# EAGLE design qfn-10-socket-pcb-mk-1.0.0 (EAGLE 9.2.0)
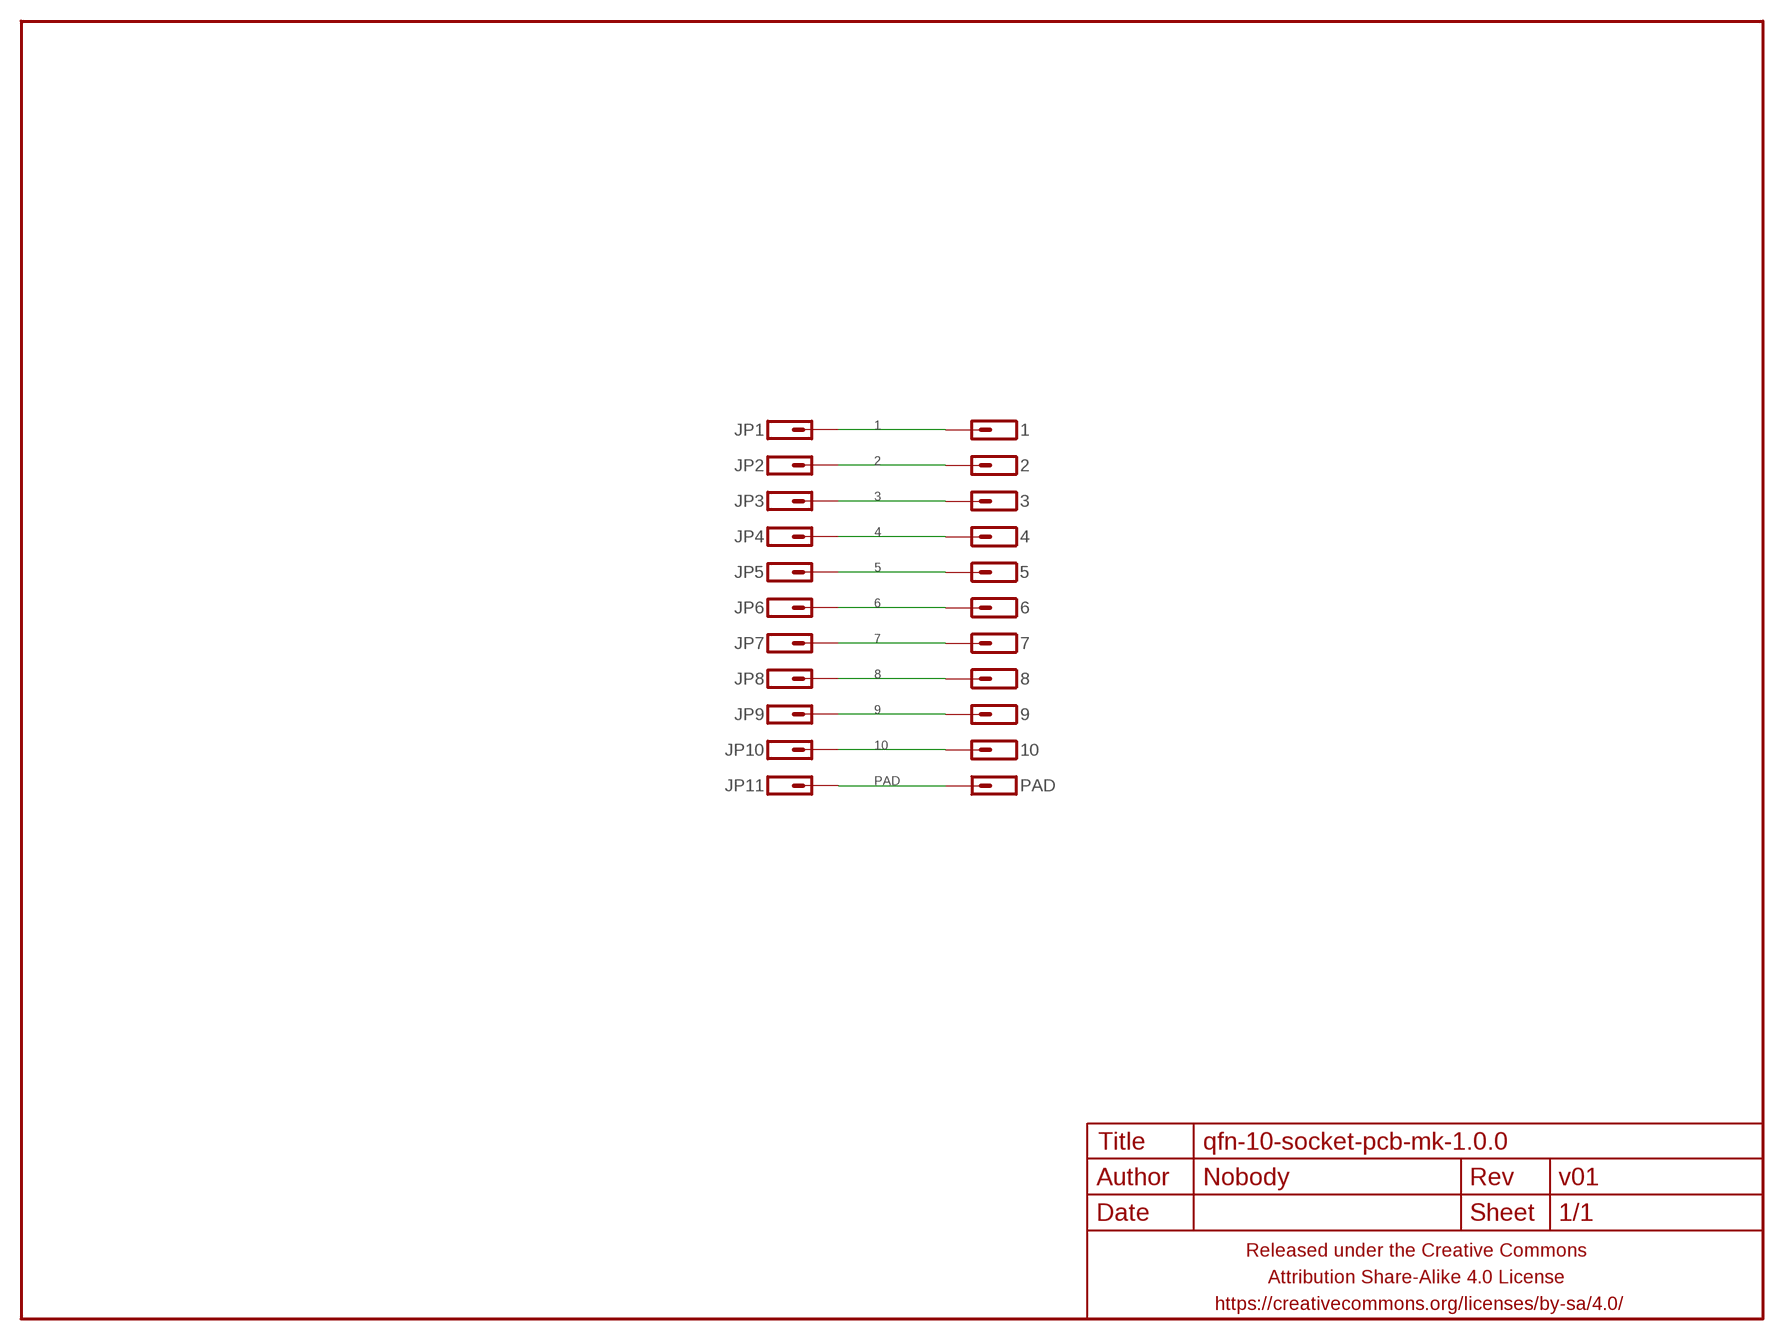
[diagram p0: schematic, sheet 1]

## Parts
1  M01PTH  [1X01]
2  M01PTH  [1X01]
3  M01PTH  [1X01]
4  M01PTH  [1X01]
5  M01PTH  [1X01]
6  M01PTH  [1X01]
7  M01PTH  [1X01]
8  M01PTH  [1X01]
9  M01PTH  [1X01]
10  M01PTH  [1X01]
FRAME1  FRAME-LETTERNO_PACKAGE  [DUMMY]
JP1  M01PTH-0.4MM  [1X01-0.4MM]
JP2  M01PTH-0.4MM  [1X01-0.4MM]
JP3  M01PTH-0.4MM  [1X01-0.4MM]
JP4  M01PTH-0.4MM  [1X01-0.4MM]
JP5  M01PTH-0.4MM  [1X01-0.4MM]
JP6  M01PTH-0.4MM  [1X01-0.4MM]
JP7  M01PTH-0.4MM  [1X01-0.4MM]
JP8  M01PTH-0.4MM  [1X01-0.4MM]
JP9  M01PTH-0.4MM  [1X01-0.4MM]
JP10  M01PTH-0.4MM  [1X01-0.4MM]
JP11  M01PTH  [1X01]
PAD  M01PTH-3.3MM  [1X01-3.3MM]

## Nets
1: 1.1 JP1.P$1
2: 2.1 JP2.P$1
3: 3.1 JP3.P$1
4: 4.1 JP4.P$1
5: 5.1 JP5.P$1
6: 6.1 JP6.P$1
7: 7.1 JP7.P$1
8: 8.1 JP8.P$1
9: 9.1 JP9.P$1
10: 10.1 JP10.P$1
PAD: JP11.1 PAD.P$1

## Library data of the parts
1-10 JP1-JP11 PAD = a_parts:M01: Header 1 Standard 1-pin 0.1" header. Use with straight break away headers (SKU : PRT-00116), right angle break away headers (PRT-00553), swiss pins (PRT-00743), machine pins (PRT-00117), and female headers (PRT-00115).
FRAME1 = a_parts:FRAME-LETTER: Schematic Frame Standard 8.5x11 US Letter frame; DESIGNER: Nobody; VERSION: v01

## Board
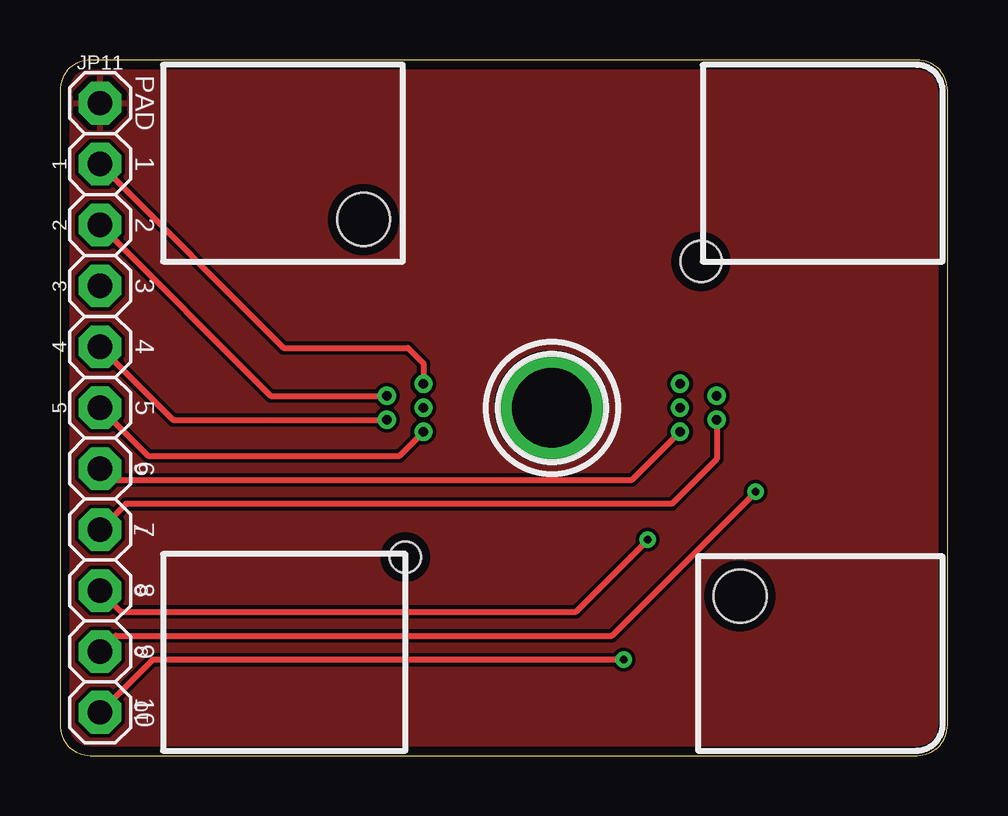
[diagram p1: board, top side]
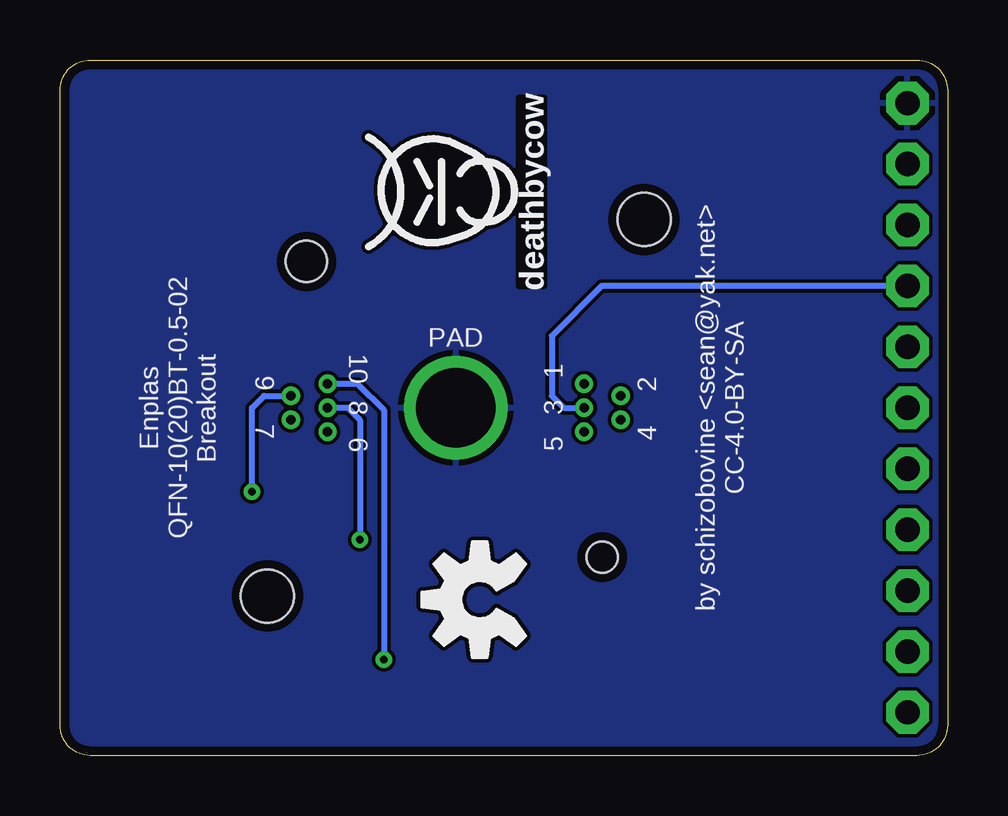
[diagram p2: board, bottom side, seen from below]

Size 37 x 29 mm. Coordinates in mm from the lower left corner, seen from the top.
Outline: 0,27.73 0,1.27 arc90 1.27,0 35.73,0 arc90 37,1.27 37,27.73 arc90 35.73,29 1.27,29 arc90 0,27.73
Copper layers (1*16): Top 0.0356mm / dielectric 1.5011mm / Bottom 0.0356mm
Design rules "LaenPCBOrder_2": minimum track width 6mil, minimum drill 13mil, track to track 6mil, track to pad 6mil, pad to pad 6mil, via to via 6mil, smd to smd 6mil, copper to edge 15mil, drill to drill 6mil, minimum pad ring 7mil, minimum via ring 7mil, stop-mask expansion 3mil, vias tented up to drill 20mil, thermal gap 10mil
Holes 2.2 mm at 12.65,22.35 28.35,6.65
Holes 1.7 mm at 26.73,20.6
Holes 1.3 mm at 14.4,8.28
vRestrict: area 4,20.6 to 14.3,29; area 26.7,20.6 to 37,29; area 4,0 to 14.4,8.4; area 26.6,0 to 37,8.4

### Footprints (pad centres in the part's own frame; a part is rotated, then mirrored left to right if it is on the bottom)
1X01 = drill 1.016 pad 1.778 octagon: 1 0,0
1X01-0.4MM = drill 0.4: P$1 0,0
1X01-3.3MM = drill 3.3: P$1 0,0

### Placement (x,y rotation side)
1  1.67,24.66 90 top
2  1.67,22.12 90 top
3  1.67,19.58 90 top
4  1.67,17.04 90 top
5  1.67,14.5 90 top
6  1.67,11.96 270 top
7  1.67,9.42 270 top
8  1.67,6.88 270 top
9  1.67,4.34 270 top
10  1.67,1.8 270 top
FRAME1  0,0 0 top
JP1  15.15,15.5 0 top
JP2  13.62,15 0 top
JP3  15.15,14.5 0 top
JP4  13.62,14 0 top
JP5  15.15,13.5 0 top
JP6  25.85,13.5 0 top
JP7  27.38,14 0 top
JP8  25.85,14.5 0 top
JP9  27.38,15 0 top
JP10  25.85,15.5 0 top
JP11  1.67,27.2 0 top
PAD  20.5,14.5 0 top
U$1  [COW_SMALL_METAL]  21.6,23.5 90 bottom
U$2  [OSHWLOGO_5MM_METAL]  19.5,6.5 90 bottom

### Tracks (layer width: path | path; a pad name or v marks a point on that pad's centre or on a via)
1
  Top 0.25: 1.1 9.33,17 14.5,17 15.15,16.35 JP1.P$1
2
  Top 0.25: 2.1 8.79,15 JP2.P$1
3
  Bottom 0.25: 3.1 14.42,19.58 16.5,17.5 16.5,15 16,14.5 JP3.P$1
4
  Top 0.25: 4.1 4.71,14 JP4.P$1
5
  Top 0.25: 5.1 3.67,12.5 14.15,12.5 JP5.P$1
6
  Top 0.25: 6.1 2.13,11.5 23.85,11.5 JP6.P$1
7
  Top 0.25: 7.1 2.75,10.5 25.5,10.5 27.38,12.38 JP7.P$1
8  (via drill 0.33)
  Top 0.25: 8.1 2.55,6 21.5,6 v24.5,9
  Bottom 0.25: v24.5,9 24.5,14 25,14.5 JP8.P$1
9  (via drill 0.33)
  Top 0.25: 9.1 2.33,5 23,5 v29,11
  Bottom 0.25: v29,11 29,14.5 28.5,15 JP9.P$1
10  (via drill 0.33)
  Top 0.25: 10.1 3.87,4 v23.5,4
  Bottom 0.25: v23.5,4 23.5,14.4 24.6,15.5 JP10.P$1
PAD
  pour Top: 0,0 37,0 37,29 0,29
  pour Bottom: 0,0 37,0 37,29 0,29

### Text on the board
bPlace: by schizobovine <sean@yak.net> / CC-4.0-BY-SA | Enplas / QFN-10(20)BT-0.5-02 / Breakout
tNames: PAD | 1 | 2 | 3 | 4 | 5 | 6 | 7 | 8 | 9 | 10
bNames: PAD | 1 | 10 | 9 | 2 | 3 | 8 | 7 | 4 | 5 | 6